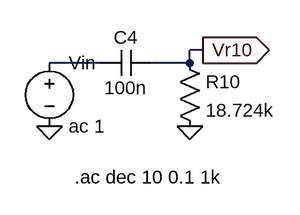
[diagram p0: schematic HPF.asc]
HPF.asc, the LTspice schematic file:
Version 4
SHEET 1 880 680
WIRE 384 256 368 256
WIRE 256 272 192 272
WIRE 368 272 368 256
WIRE 368 272 320 272
FLAG 192 352 0
FLAG 368 352 0
FLAG 384 256 Vr10
IOPIN 384 256 Out
SYMBOL Voltage 192 256 R0
SYMATTR InstName Vin
SYMATTR Value ac 1
SYMBOL Res 352 256 R0
SYMATTR InstName R10
SYMATTR Value 18.724k
SYMBOL Cap 320 256 R90
WINDOW 0 0 32 VBottom 2
WINDOW 3 32 32 VTop 2
SYMATTR InstName C4
SYMATTR Value 100n
TEXT 224 416 Left 2 !.ac dec 10 0.1 1k

The netlist it stands for:
* HPF.asc
Vin N001 0 ac 1
R10 Vr10 0 18.724k
C4 Vr10 N001 100n
.ac dec 10 0.1 1k
.backanno
.end